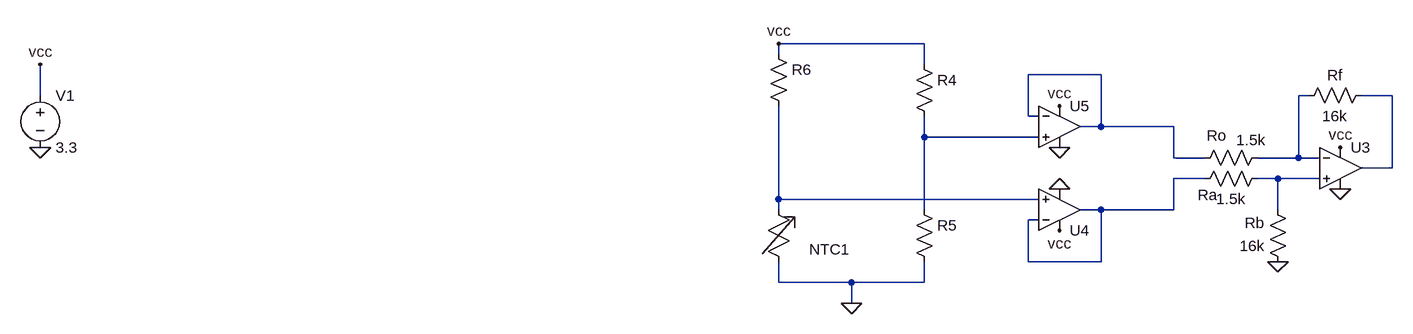
[diagram p0: schematic NTCDiffAmp.asc]
NTCDiffAmp.asc, the LTspice schematic file:
Version 4
SHEET 1 4004 680
WIRE 1488 32 1264 32
WIRE 1264 48 1264 32
WIRE 1488 64 1488 32
WIRE 1760 80 1648 80
WIRE 128 112 128 64
WIRE 2080 112 2064 112
WIRE 2208 112 2160 112
WIRE 1648 144 1648 80
WIRE 1664 144 1648 144
WIRE 1760 160 1760 80
WIRE 1760 160 1728 160
WIRE 1872 160 1760 160
WIRE 1488 176 1488 144
WIRE 1664 176 1488 176
WIRE 1872 208 1872 160
WIRE 1920 208 1872 208
WIRE 2064 208 2064 112
WIRE 2064 208 2000 208
WIRE 2096 208 2064 208
WIRE 2208 224 2208 112
WIRE 2208 224 2160 224
WIRE 1920 240 1872 240
WIRE 2032 240 2000 240
WIRE 2096 240 2032 240
WIRE 1264 272 1264 128
WIRE 1664 272 1264 272
WIRE 1264 288 1264 272
WIRE 1488 288 1488 176
WIRE 1760 288 1728 288
WIRE 1872 288 1872 240
WIRE 1872 288 1760 288
WIRE 2032 288 2032 240
WIRE 1664 304 1648 304
WIRE 1648 368 1648 304
WIRE 1760 368 1760 288
WIRE 1760 368 1648 368
WIRE 1264 400 1264 368
WIRE 1376 400 1264 400
WIRE 1488 400 1488 368
WIRE 1488 400 1376 400
WIRE 1376 432 1376 400
FLAG 128 192 0
FLAG 128 64 vcc
FLAG 2128 256 0
FLAG 2128 192 vcc
FLAG 1696 320 vcc
FLAG 1696 256 0
FLAG 2032 368 0
FLAG 1696 128 vcc
FLAG 1696 192 0
FLAG 1376 432 0
FLAG 1264 32 vcc
SYMBOL Voltage 128 96 R0
SYMATTR InstName V1
SYMATTR Value 3.3
SYMBOL UniversalOpAmp 2128 224 R0
SYMATTR InstName U3
SYMBOL res 2048 384 R180
WINDOW 0 36 76 Left 2
WINDOW 3 36 40 Left 2
SYMATTR InstName Rb
SYMATTR Value 16k
SYMBOL res 2016 224 R90
WINDOW 0 57 92 VBottom 2
WINDOW 3 32 56 VTop 2
SYMATTR InstName Ra
SYMATTR Value 1.5k
SYMBOL UniversalOpAmp 1696 288 M180
SYMATTR InstName U4
SYMBOL res 2016 192 R90
WINDOW 0 -3 78 VBottom 2
WINDOW 3 -27 25 VTop 2
SYMATTR InstName Ro
SYMATTR Value 1.5k
SYMBOL res 2176 96 R90
WINDOW 0 0 56 VBottom 2
WINDOW 3 32 56 VTop 2
SYMATTR InstName Rf
SYMATTR Value 16k
SYMBOL UniversalOpAmp 1696 160 R0
SYMATTR InstName U5
SYMBOL res 1472 48 R0
SYMATTR InstName R4
SYMATTR Value ""
SYMBOL res 1472 272 R0
SYMATTR InstName R5
SYMATTR Value ""
SYMBOL VarRes 1248 272 R0
SYMATTR InstName NTC1
SYMATTR Value ""
SYMBOL res 1248 32 R0
SYMATTR InstName R6
SYMATTR Value ""

The netlist it stands for:
* NTCDiffAmp.asc
V1 vcc 0 3.3
XU3 N006 N002 vcc 0 N003 level1 Avol=1Meg GBW=10Meg Vos=0 En=0 Enk=0 In=0 Ink=0 Rin=500Meg  ; pins In+ In- V+ V- OUT
Rb 0 N006 16k
Ra N006 N005 1.5k
XU4 N007 N005 vcc 0 N005 level1 Avol=1Meg GBW=10Meg Vos=0 En=0 Enk=0 In=0 Ink=0 Rin=500Meg  ; pins In+ In- V+ V- OUT
Ro N002 N001 1.5k
Rf N003 N002 16k
XU5 N004 N001 vcc 0 N001 level1 Avol=1Meg GBW=10Meg Vos=0 En=0 Enk=0 In=0 Ink=0 Rin=500Meg  ; pins In+ In- V+ V- OUT
R4 vcc N004
R5 N004 0
R§NTC1 N007 0
R6 vcc N007
.lib UniversalOpAmp1.lib
.backanno
.end